# Altium schematic sheet l7.schdoc
size 325 x 172 mm
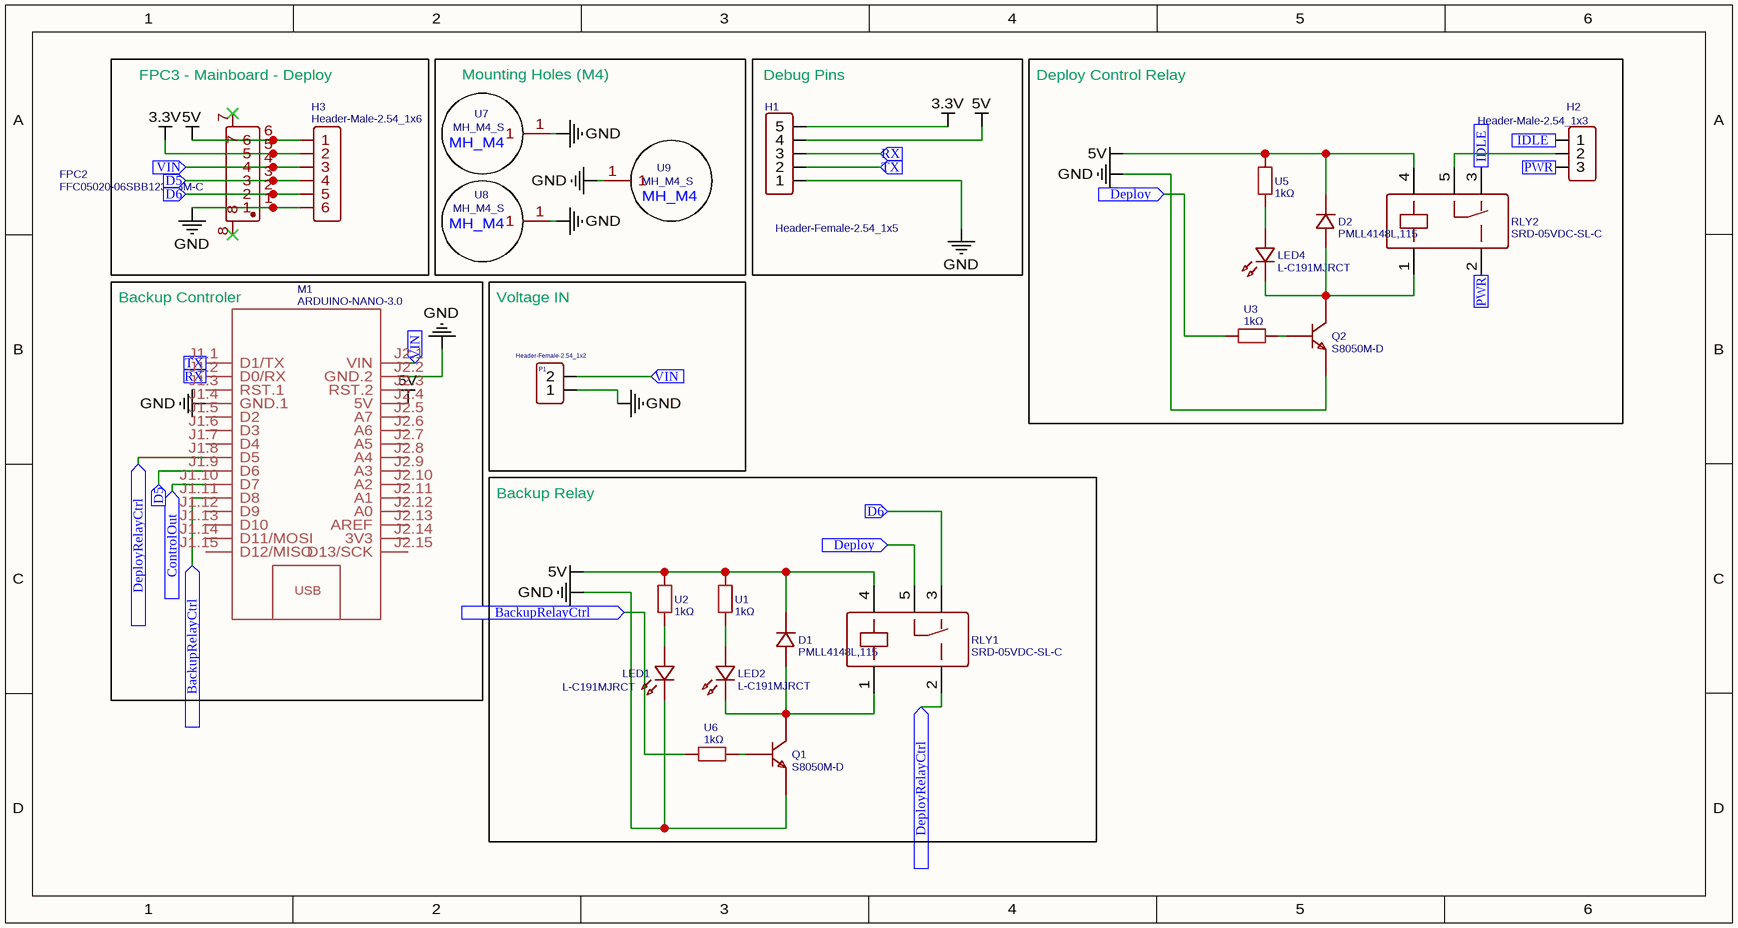
[diagram p0: l7.schdoc]

## Parts
D1  PMLL4148L,115  [SOD-80_L3.5-W1.5-RD]
D2  PMLL4148L,115  [SOD-80_L3.5-W1.5-RD]
FPC2  FFC05020-06SBB123W5M-C  [FFC-SMD_6P-P0.50_FFC05020-06SBB123W5M]
H1  Header-Female-2.54_1x5  [HDR-TH_5P-P2.54-V-F]
H2  Header-Male-2.54_1x3  [HDR-TH_3P-P2.54-V-M-1]
H3  Header-Male-2.54_1x6  [HDR-TH_6P-P2.54-V-M-1]
LED1  L-C191MJRCT  [LED0603-RD_RED]
LED2  L-C191MJRCT  [LED0603-RD_RED]
LED4  L-C191MJRCT  [LED0603-RD_RED]
M1  ARDUINO-NANO-3.0  [ARDUINO-NANO-3.0]
P1  Header-Female-2.54_1x2  [HDR-TH_2P-P2.54-V-F]
Q1  S8050M-D  [SOT-23-3_L3.0-W1.7-P0.95-LS2.9-BR]
Q2  S8050M-D  [SOT-23-3_L3.0-W1.7-P0.95-LS2.9-BR]
RLY1  SRD-05VDC-SL-C  [RELAY-TH_SRD-XXVDC-XL-C]
RLY2  SRD-05VDC-SL-C  [RELAY-TH_SRD-XXVDC-XL-C]
U1  1kΩ  [R0402]
U2  1kΩ  [R0402]
U3  1kΩ  [R0402]
U5  1kΩ  [R0402]
U6  1kΩ  [R0402]
U7  MH_M4_S  [MH_M4_PCB]
U8  MH_M4_S  [MH_M4_PCB]
U9  MH_M4_S  [MH_M4_PCB]

## Blocks framed on the sheet
FPC3 - Mainboard - Deploy: FPC2 H3
Mounting Holes (M4): U7-U9
Debug Pins: H1
Deploy Control Relay: D2 H2 LED4 Q2 RLY2 U3 U5
Backup Controler: M1
Voltage IN: P1
Backup Relay: D1 LED1 LED2 Q1 RLY1 U1 U2 U6

## Ports
BackupRelayCtrl (in), ControlOut (in), D5 (in), D6 (in), Deploy (in), DeployRelayCtrl (in), IDLE (in), PWR (in), RX (in), TX (in), VIN (in)

## Nets
3.3V: FPC2.5 H1.5 H3.2
5V: D1.1(K) D2.1(K) FPC2.6 H1.4 H3.1 M1.J2.4(5V) RLY1.4 RLY2.4 U1.2 U2.2 U5.2
GND: FPC2.1 H1.1 H3.6 LED1.1(K) M1.J1.4(GND.1) M1.J2.2(GND.2) P1.1 Q1.2(E) Q2.2(E) U7.1 U8.1 U9.1
BackupRelayCtrl: M1.J1.11(D8) U6.1 ; port BackupRelayCtrl
ControlOut: M1.J1.10(D7) ; port ControlOut
D5: FPC2.3 H3.4 M1.J1.9(D6) ; port D5
D6: FPC2.2 H3.5 RLY1.3 ; port D6
Deploy: RLY1.5 U3.1 ; port Deploy
DeployRelayCtrl: M1.J1.8(D5) RLY1.2 ; port DeployRelayCtrl
IDLE: H2.1 RLY2.3 ; port IDLE
PWR: H2.3 RLY2.2 ; port PWR
RX: H1.3 M1.J1.2(D0/RX) ; port RX
TX: H1.2 M1.J1.1(D1/TX) ; port TX
VIN: FPC2.4 H3.3 M1.J2.1(VIN) P1.2 ; port VIN
NetD1_2: D1.2(A) LED2.1(K) Q1.3(C) RLY1.1
NetD2_2: D2.2(A) LED4.1(K) Q2.3(C) RLY2.1
NetH2_2: H2.2 RLY2.5
NetLED1_2: LED1.2(A) U2.1
NetLED2_2: LED2.2(A) U1.1
NetLED4_2: LED4.2(A) U5.1
NetQ1_1: Q1.1(B) U6.2
NetQ2_1: Q2.1(B) U3.2

Not connected (* = marked no-connect by the designer): FPC2 7* 8*; M1 J1.3(RST.1) J1.5(D2) J1.6(D3) J1.7(D4) J1.12(D9) J1.13(D10) J1.14(D11/MOSI) J1.15(D12/MISO) J2.3(RST.2) J2.5(A7) J2.6(A6) J2.7(A5) J2.8(A4) J2.9(A3) J2.10(A2) J2.11(A1) J2.12(A0) J2.13(AREF) J2.14(3V3) J2.15(D13/SCK)

## Notes on the sheet
- (in symbol ARDUINO-NANO-3.0) USB
- (in symbol MH_M4_S) MH_M4

## Library data of the parts
D1 D2 = PMLL4148L,115: Manufacturer: Nexperia(安世); Supplier: LCSC; Manufacturer Part: PMLL4148L,115; Supplier Part: C78613; JLCPCB Part Class: Extended Part; spicePre: D; spiceSymbolName: PMLL4148L,115
FPC2 = FFC05020-06SBB123W5M-C: Manufacturer: TXGA(特思嘉); Contributor: LCSC; Supplier: LCSC; Supplier Part: C456448; Manufacturer Part: FFC05020-06SBB123W5M-C; JLCPCB Part Class: Extended Part; spicePre: F; spiceSymbolName: FFC05020-06SBB123W5M-C
H1 = Header-Female-2.54_1x5: Manufacturer: BOOMELE(博穆精密); Manufacturer Part: 2.54-1*5P母; Supplier: LCSC; Supplier Part: C50950; JLCPCB Part Class: Extended Part; spicePre: H; spiceSymbolName: Header-Female-2.54_1x5
H2 = Header-Male-2.54_1x3: Manufacturer: BOOMELE(博穆精密); Manufacturer Part: 2.54-1*3P针; Supplier: LCSC; Supplier Part: C49257; JLCPCB Part Class: Extended Part; spicePre: H; spiceSymbolName: Header-Male-2.54_1x3
H3 = Header-Male-2.54_1x6: Manufacturer: BOOMELE(博穆精密); Manufacturer Part: 2.54-1x6P直针; Supplier: LCSC; Supplier Part: C37208; JLCPCB Part Class: Extended Part; spicePre: H; spiceSymbolName: Header-Male-2.54_1x6
LED1 LED2 LED4 = L-C191MJRCT: Manufacturer: PARALIGHT(光鼎); Contributor: lcsc; Supplier: LCSC; Supplier Part: C2962776; Manufacturer Part: L-C191MJRCT; JLCPCB Part Class: Extended Part; spicePre: L; spiceSymbolName: L-C191MJRCT
M1 = ARDUINO-NANO-3.0: Contributor: sirapat pholwa; spicePre: M; spiceSymbolName: ARDUINO-NANO-3.0
P1 = Header-Female-2.54_1x2: Manufacturer: BOOMELE(博穆精密); Manufacturer Part: 2.54-1*2P母; Supplier: LCSC; Supplier Part: C49661; JLCPCB Part Class: Extended Part; spicePre: P; spiceSymbolName: Header-Female-2.54_1x2
Q1 Q2 = S8050M-D: Manufacturer: BLUE ROCKET(蓝箭); Manufacturer Part: S8050M-D HY3D; Contributor: LCSC; Supplier: LCSC; Supplier Part: C305482; JLCPCB Part Class: Extended Part; spicePre: Q; spiceSymbolName: S8050M-D
RLY1 RLY2 = SRD-05VDC-SL-C: Manufacturer: 松乐; Supplier: LCSC; Manufacturer Part: SRD-05VDC-SL-C; Supplier Part: C35449; JLCPCB Part Class: Extended Part; spicePre: R; spiceSymbolName: SRD-05VDC-SL-C
U1-U3 U5 U6 = 1kΩ: Manufacturer: Sunway(信维通信); Manufacturer Part: SC0402J1001F2ANRH; Contributor: lcsc; nameAlias: Value; Supplier: LCSC; Supplier Part: C3152105; JLCPCB Part Class: Extended Part; spicePre: U; spiceSymbolName: SC0402J1001F2ANRH
U7-U9 = MH_M4_S: Contributor: js314dev; spicePre: U; spiceSymbolName: MH_M4_S